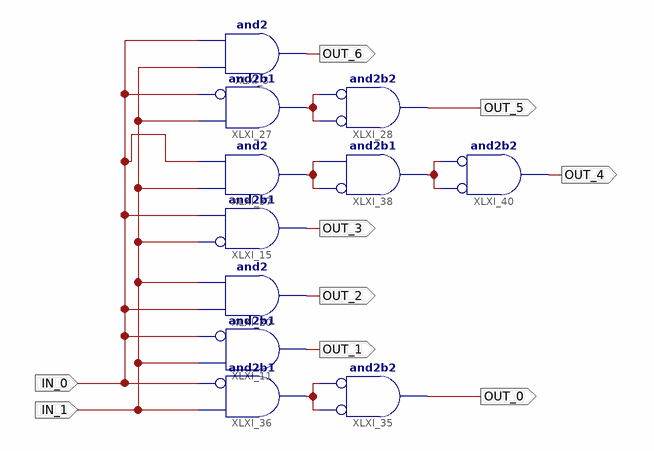
[diagram p0: schematic sheet 1]
// Xilinx ISE schematic My2to7.sch (spartan3a) as structural Verilog: 11 symbols, 9 ports
module My2to7 (
  input  IN_0,
  input  IN_1,
  output OUT_0,
  output OUT_1,
  output OUT_2,
  output OUT_3,
  output OUT_4,
  output OUT_5,
  output OUT_6
);

  wire XLXN_9, XLXN_17, XLXN_19, XLXN_22;

  and XLXI_3 (OUT_6, IN_1, IN_0);
  and XLXI_15 (OUT_3, ~IN_1, IN_0);  // and2b1
  and XLXI_20 (OUT_2, IN_0, IN_1);
  and XLXI_27 (XLXN_9, ~IN_0, IN_1);  // and2b1
  and XLXI_28 (OUT_5, ~XLXN_9, ~XLXN_9);  // and2b2
  and XLXI_11 (OUT_1, ~IN_0, IN_1);  // and2b1
  and XLXI_35 (OUT_0, ~XLXN_17, ~XLXN_17);  // and2b2
  and XLXI_36 (XLXN_17, ~IN_0, IN_1);  // and2b1
  and XLXI_37 (XLXN_19, IN_1, IN_0);
  and XLXI_38 (XLXN_22, ~XLXN_19, XLXN_19);  // and2b1
  and XLXI_40 (OUT_4, ~XLXN_22, ~XLXN_22);  // and2b2
endmodule
